# EasyEDA schematic integracion2025.json
TITLE: Sheet_1; REV: 1.0; Date: 2025-10-22; Sheet: 1/1; Company: Universidad de Oviedo
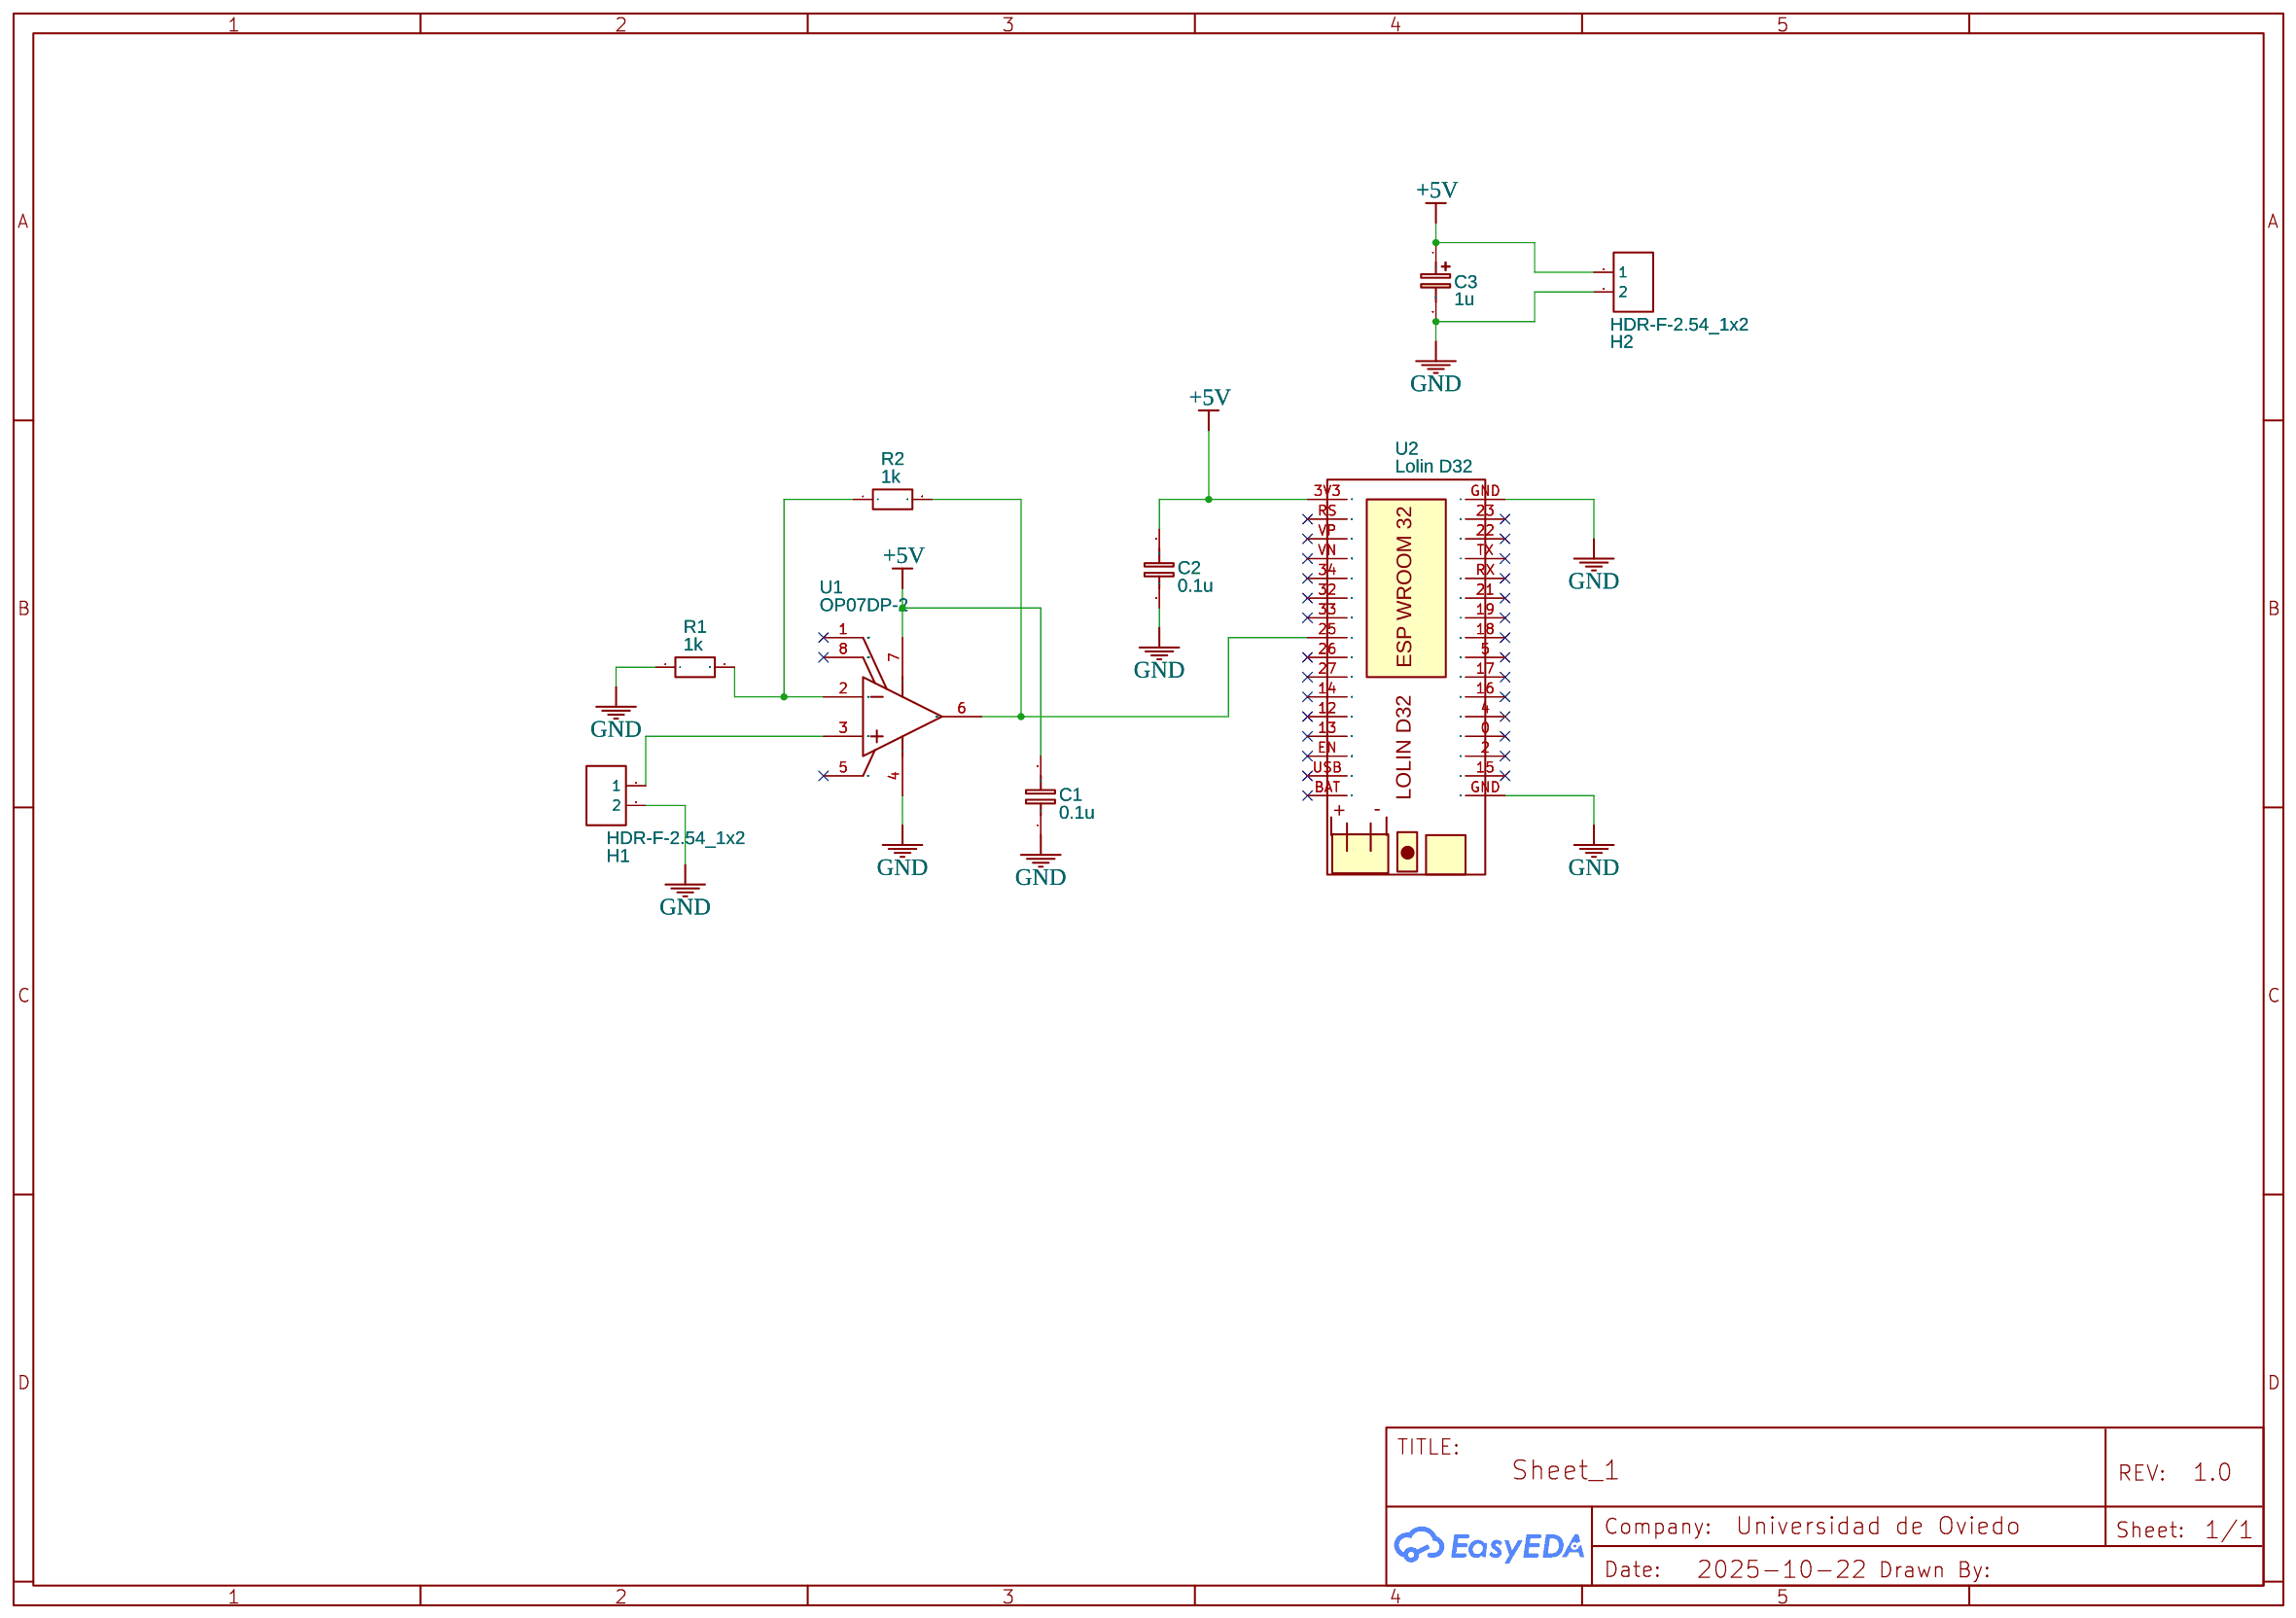
[diagram p0: schematic sheet]

## Parts
C1  0.1u  [C0603]
C2  0.1u  [C0603]
C3  1u  [CASE-A_3216]
H1  HDR-F-2.54_1x2  [HDR-F-2.54_1X2]
H2  HDR-F-2.54_1x2  [HDR-F-2.54_1X2]
R1  1k  [R0603]
R2  1k  [R0603]
U1  OP07DP-2  [PDIP-8_L9.6-W6.4-P2.54-LS7.9-BL]
U2  Lolin D32  [WEMOS_LOLIND32_V1.0.0]

## Library data of the parts
C1 C2 = C_0603_EU: Contributor: LCEDA_Lib
C3 = C_Tan_SMD_A_EU: Contributor: LCEDA_Lib
H1 H2 = HDR-F-2.54_1x2: Supplier Part: C49661; Supplier: LCSC; Contributor: LCEDA_Lib
R1 R2 = R_0603_EU: Contributor: LCEDA_Lib
U1 = OP07DP-2: Contributor: lcsc; Supplier: LCSC; Supplier Part: C4367219; Manufacturer: ADI(亚德诺)/MAXIM(美信); JLCPCB Part Class: Extended Part
U2 = Lolin D32: Manufacturer Part: New SchematicLib; Contributor: CharlyATC; Supplier: Wemos

## Nets
+5V: C1.2 C2.2 C3.1 H2.1 U1.7(V+) U2.3V3(17)
GND: C1.1 C2.1 C3.2 H1.2 H2.2 R1.1 U1.4(V-) U2.GND(16)
Net-(H1-1): H1.1 U1.3(+IN A)
Net-(R1-2): R1.2 R2.1 U1.2(-IN A)
Net-(R2-2): R2.2 U1.6(OUT A) U2.25(24)

Not connected (* = marked no-connect by the designer): U1 1(VOS TRIM)* 5(NC)* 8(VOS TRIM)*; U2 0(13)* 2(14)* 4(12)* 5(9)* 12(28)* 13(29)* 14(27)* 15* 16(11)* 17(10)* 18(8)* 19(7)* 21(6)* 22(3)* 23(2)* 26(25)* 27(26)* 32(22)* 33(23)* 34(21)* BAT(32)* EN(30)* RS(18)* RX(5)* TX(4)* USB(31)* VN(20)* VP(19)*
